# Altium schematic sheet GATE_DRIVER_BOARD.SchDoc
size A2; SheetNumber: 1; SheetTotal: 1; SPICEModelCacheUJGLTUQW: <root> / <DocumentId>UJGLTUQW</DocumentId> / <CacheFrame Number="0"> / <Model Name="7850_744775239_390u" Kind="CKT"> / <Text>******* / .subckt 7850_744775239_390u 1 2 / Rp 1 2 180000 / Cp 1 2 5p / Rs 1 N3 1.151 / L1 N3 2 390u / .ends 7850_744775239_390u</Text> / </Model> / </CacheFrame> / </root>
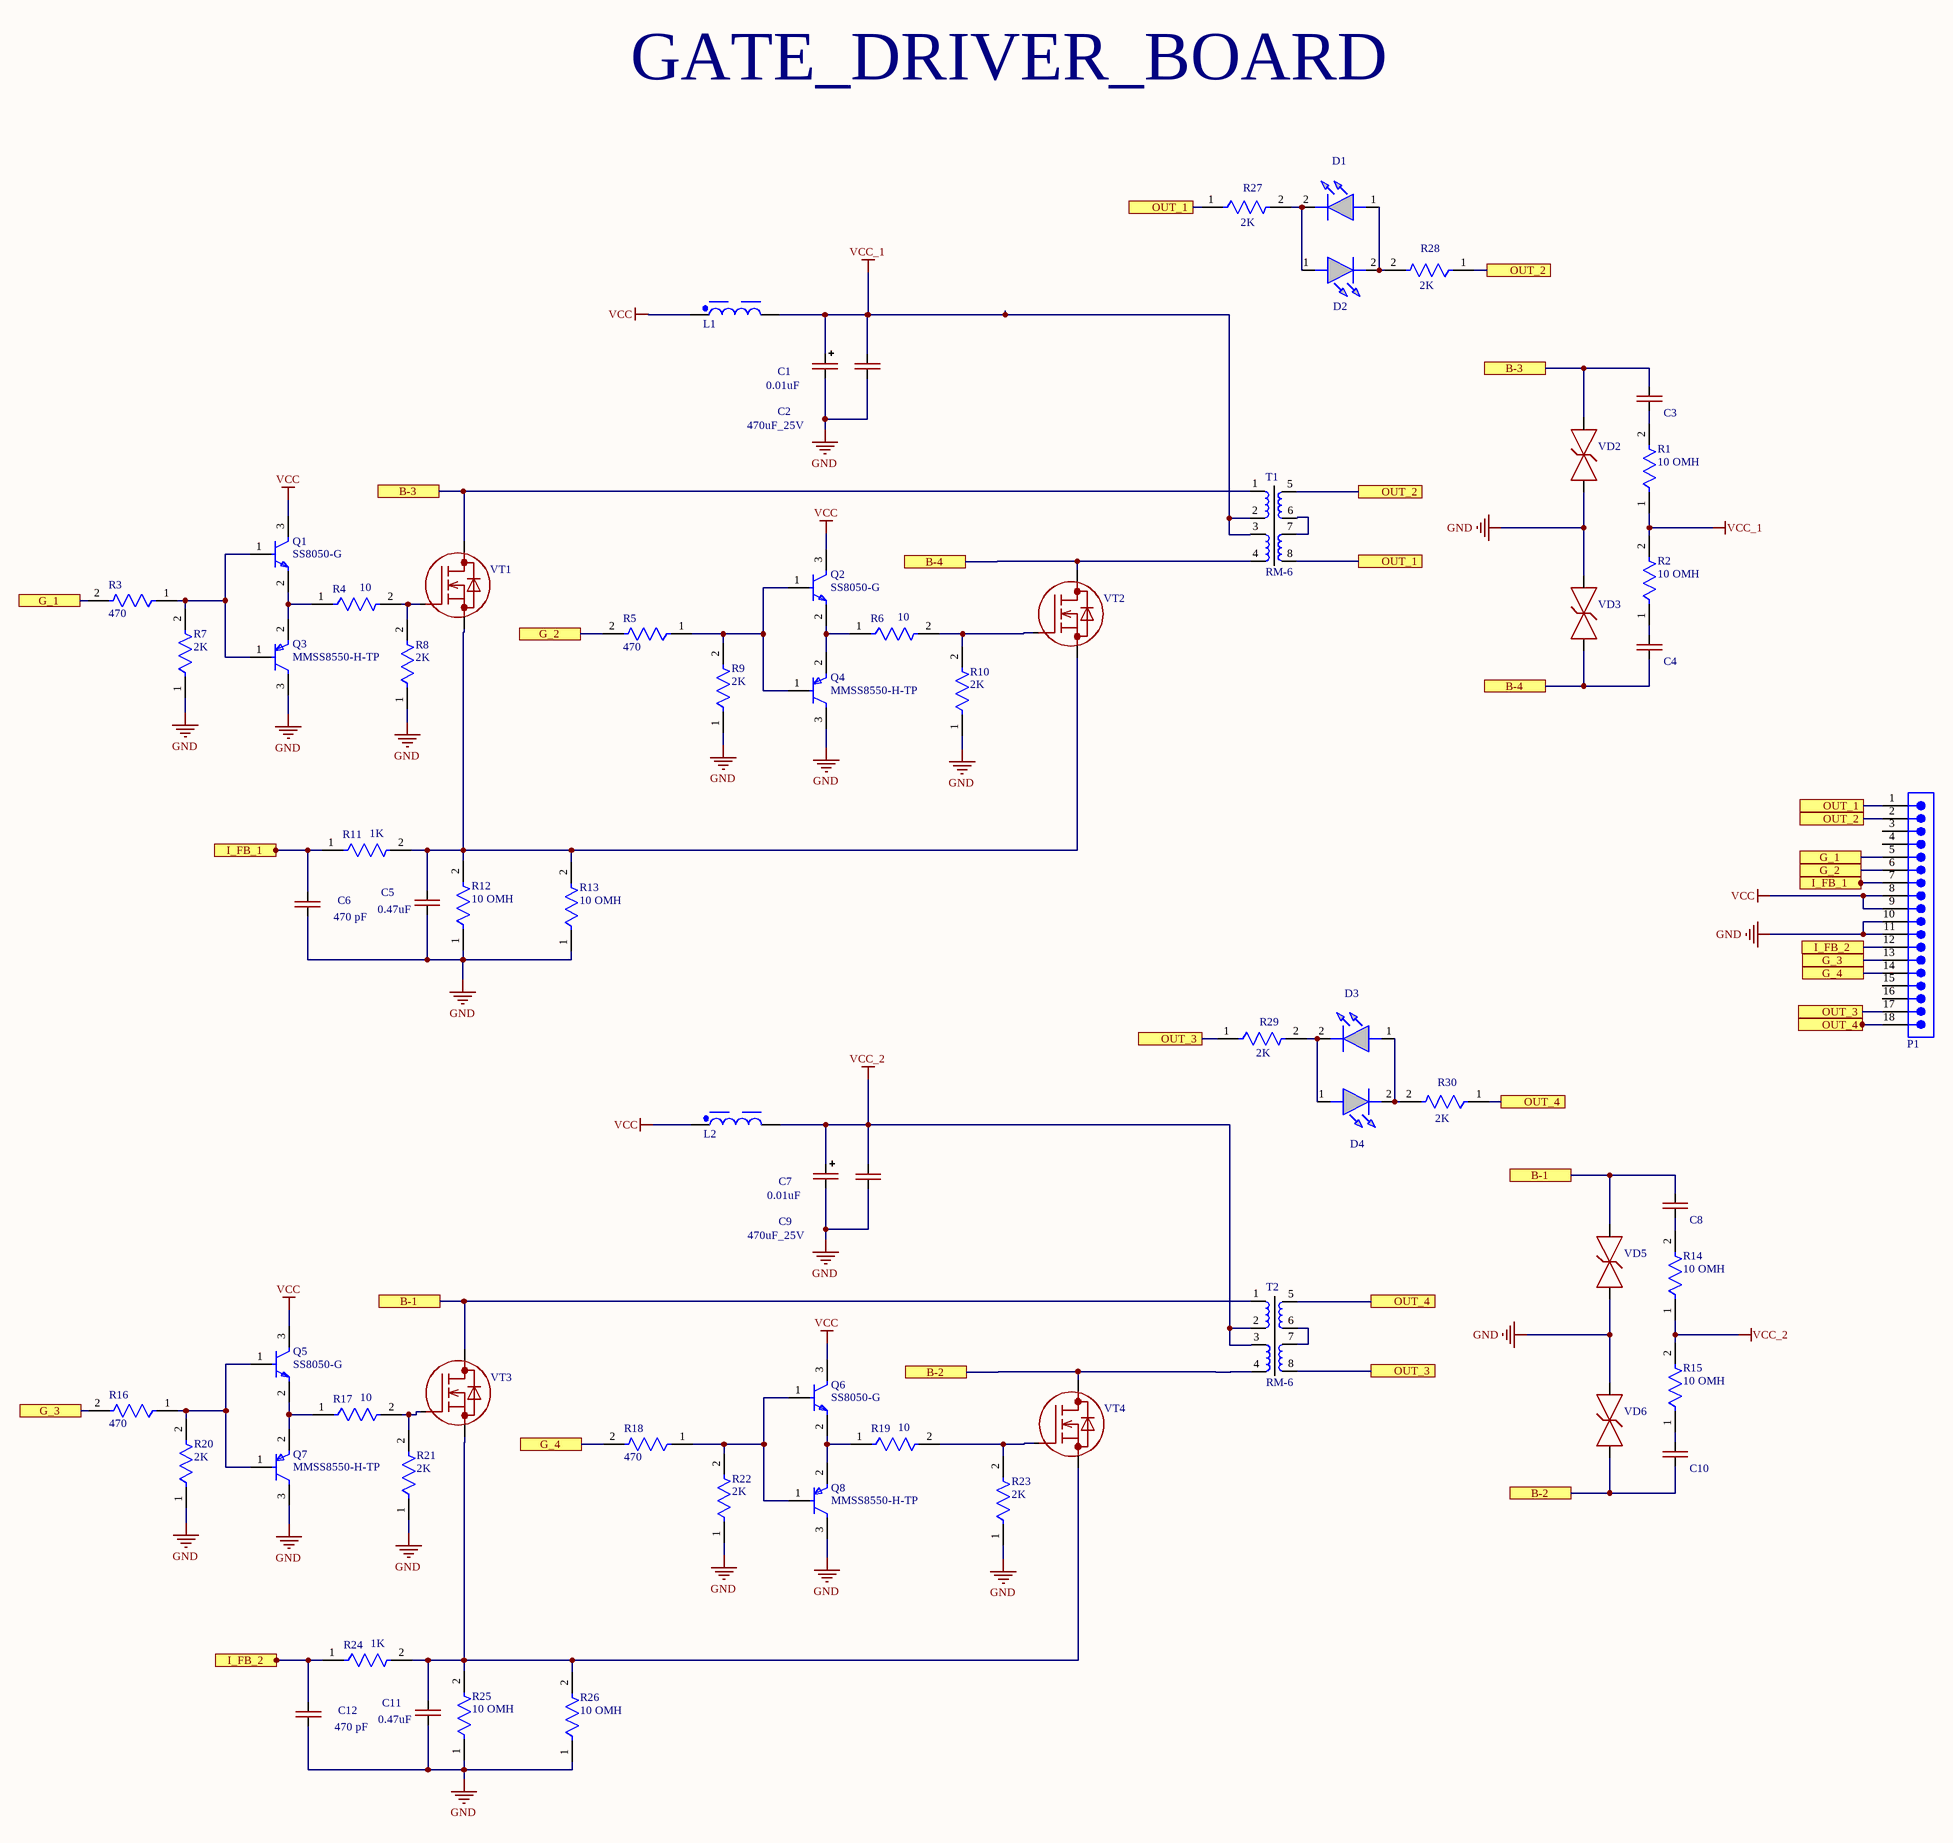
[diagram p0: GATE_DRIVER_BOARD.SchDoc]

## Parts
C1  0.01uF  [CAP-0805]
C2  470uF_25V  [CAP_SMD_Size_G]
C3  CAP-V  [CAP-V]  (value not drawn)
C4  CAP-V  [CAP-V]  (value not drawn)
C5  0.47uF  [CAP-0805]
C6  470 pF  [CAP-0805]
C7  0.01uF  [CAP-0805]
C8  CAP-V  [CAP-V]  (value not drawn)
C9  470uF_25V  [CAP_SMD_Size_G]
C10  CAP-V  [CAP-V]  (value not drawn)
C11  0.47uF  [CAP-0805]
C12  470 pF  [CAP-0805]
D1  151031YS06000  [LED_RED]  (value not drawn)
D2  151031YS06000  [LED_RED]  (value not drawn)
D3  151031YS06000  [LED_RED]  (value not drawn)
D4  151031YS06000  [LED_RED]  (value not drawn)
L1  390µH, 0.38A  [WE-PD2_7850]  (value not drawn)
L2  390µH, 0.38A  [WE-PD2_7850]  (value not drawn)
P1  61301811021  [61301811021]  (value not drawn)
Q1  SS8050-G  [FP-SS8050-G-MFG]
Q2  SS8050-G  [FP-SS8050-G-MFG]
Q3  MMSS8550-H-TP  [FP-SOT-23-IPC_B]
Q4  MMSS8550-H-TP  [FP-SOT-23-IPC_B]
Q5  SS8050-G  [FP-SS8050-G-MFG]
Q6  SS8050-G  [FP-SS8050-G-MFG]
Q7  MMSS8550-H-TP  [FP-SOT-23-IPC_B]
Q8  MMSS8550-H-TP  [FP-SOT-23-IPC_B]
R1  10 OMH  [RES-1206]
R2  10 OMH  [RES-1206]
R3  470  [RES-0805]
R4  10  [RES-0805]
R5  470  [RES-0805]
R6  10  [RES-0805]
R7  2K  [RES-0805]
R8  2K  [RES-0805]
R9  2K  [RES-0805]
R10  2K  [RES-0805]
R11  1K  [RES-0805]
R12  10 OMH  [RES-2512]
R13  10 OMH  [RES-2512]
R14  10 OMH  [RES-1206]
R15  10 OMH  [RES-1206]
R16  470  [RES-0805]
R17  10  [RES-0805]
R18  470  [RES-0805]
R19  10  [RES-0805]
R20  2K  [RES-0805]
R21  2K  [RES-0805]
R22  2K  [RES-0805]
R23  2K  [RES-0805]
R24  1K  [RES-0805]
R25  10 OMH  [RES-2512]
R26  10 OMH  [RES-2512]
R27  2K  [RES-0805]
R28  2K  [RES-0805]
R29  2K  [RES-0805]
R30  2K  [RES-0805]
T1  RM-6  [TRANS_RM6]
T2  RM-6  [TRANS_RM6]
VD2  Suppressor  [P6KE350CA]  (value not drawn)
VD3  Suppressor  [P6KE350CA]  (value not drawn)
VD5  Suppressor  [P6KE350CA]  (value not drawn)
VD6  Suppressor  [P6KE350CA]  (value not drawn)
VT1  MOSFET-N-GDS  [TO-220-5]  (value not drawn)
VT2  MOSFET-N-GDS  [TO-220-5]  (value not drawn)
VT3  MOSFET-N-GDS  [TO-220-5]  (value not drawn)
VT4  MOSFET-N-GDS  [TO-220-5]  (value not drawn)

## Ports
B-1, B-2, B-3, B-4, G_1, G_2, G_3, G_4, I_FB_1, I_FB_2, OUT_1, OUT_2, OUT_3, OUT_4

## Nets
GND: C1.1 C2.2(-) C5.1 C6.1 C7.1 C9.2(-) C11.1 C12.1 P1.10 P1.11 Q3.3(C) Q4.3(C) Q7.3(C) Q8.3(C) R7.1 R8.1 R9.1 R10.1 R12.1 R13.1 R20.1 R21.1 R22.1 R23.1 R25.1 R26.1 VD2.1(C) VD3.2(A) VD5.1(C) VD6.2(A)
VCC: L1.1 L2.1 P1.8 P1.9 Q1.3(C) Q2.3(C) Q5.3(C) Q6.3(C)
VCC_1: C1.2 C2.1(+) L1.2 R1.1 R2.2 T1.2 T1.3
VCC_2: C7.2 C9.1(+) L2.2 R14.1 R15.2 T2.2 T2.3
B-1: C8.2 T2.1 VD5.2(A) VT3.2(D) ; port B-1
B-2: C10.1 T2.4 VD6.1(C) VT4.2(D) ; port B-2
B-3: C3.2 T1.1 VD2.2(A) VT1.2(D) ; port B-3
B-4: C4.1 T1.4 VD3.1(C) VT2.2(D) ; port B-4
G_1: P1.5 R3.2 ; port G_1
G_2: P1.6 R5.2 ; port G_2
G_3: P1.13 R16.2 ; port G_3
G_4: P1.14 R18.2 ; port G_4
I_FB_1: C6.2 P1.7 R11.1 ; port I_FB_1
I_FB_2: C12.2 P1.12 R24.1 ; port I_FB_2
OUT_1: P1.1 R27.1 T1.8 ; port OUT_1
OUT_2: P1.2 R28.1 T1.5 ; port OUT_2
OUT_3: P1.17 R29.1 T2.8 ; port OUT_3
OUT_4: P1.18 R30.1 T2.5 ; port OUT_4
NetC3_1: C3.1 R1.2
NetC4_2: C4.2 R2.1
NetC5_2: C5.2 R11.2 R12.2 R13.2 VT1.3(S) VT2.3(S)
NetC8_1: C8.1 R14.2
NetC10_2: C10.2 R15.1
NetC11_2: C11.2 R24.2 R25.2 R26.2 VT3.3(S) VT4.3(S)
NetD1_1: D1.1(A) D2.2(K) R28.2
NetD1_2: D1.2(K) D2.1(A) R27.2
NetD3_1: D3.1(A) D4.2(K) R30.2
NetD3_2: D3.2(K) D4.1(A) R29.2
NetQ1_1: Q1.1(B) Q3.1(B) R3.1 R7.2
NetQ1_2: Q1.2(E) Q3.2(E) R4.1
NetQ2_1: Q2.1(B) Q4.1(B) R5.1 R9.2
NetQ2_2: Q2.2(E) Q4.2(E) R6.1
NetQ5_1: Q5.1(B) Q7.1(B) R16.1 R20.2
NetQ5_2: Q5.2(E) Q7.2(E) R17.1
NetQ6_1: Q6.1(B) Q8.1(B) R18.1 R22.2
NetQ6_2: Q6.2(E) Q8.2(E) R19.1
NetR4_2: R4.2 R8.2 VT1.1(G)
NetR6_2: R6.2 R10.2 VT2.1(G)
NetR17_2: R17.2 R21.2 VT3.1(G)
NetR19_2: R19.2 R23.2 VT4.1(G)
NetT1_6: T1.6 T1.7
NetT2_6: T2.6 T2.7

Not connected (* = marked no-connect by the designer): P1 3 4 15 16

## Notes on the sheet
- GATE_DRIVER_BOARD

## Library data of the parts
C1 C5-C7 C11 C12 = CAP-NON-POLAR
C2 C9 = CAP-POLAR
D1-D4 = LED: WURTH ELEKTRONIK - 151031YS06000 - LED, Yellow, Through Hole, T-1 (3mm), 30 mA, 2 V, 590 nm; Geometry.Height: 5.5mm; Manufacturer_Name: Wurth Elektronik; Manufacturer_Part_Number: 151031YS06000; Mouser Part Number: 710-151031YS06000; Mouser Price/Stock: https://www.mouser.co.uk/ProductDetail/Wurth-Elektronik/151031YS06000?qs=LlUlMxKIyB3xSYYW%252BcuBiQ%3D%3D; Arrow Part Number: *; Arrow Price/Stock: *; Mouser Testing Part Number: *; Mouser Testing Price/Stock: *; Datasheet Link: https://katalog.we-online.de/led/datasheet/151031YS06000.pdf
L1 L2 = 744775239: WE-PD2 SMT Power Inductor, size 7850, 390µH, 0.38A, 1.77Ω; Manufacturer: Wurth Elektronik; Case/Size Code: 7850; DC Resistance: 1.151Ω; Saturation Current: 0.43A; Self Resonant Frequency: 3.9MHz; Manufacturer Part Number: 744775239; Category: Unshielded Power Inductors; Match Code: WE-PD2; ComponentLink1Description: Website Link; ComponentLink1URL: https://www.we-online.com/redexpert/article/744775239?ad; ComponentLink2Description: Datasheet Link; ComponentLink2URL: https://www.we-online.com/redexpert/spec/744775239?ad; Mount: Surface Mount; Operating Temperature Max: 125°C; Operating Temperature Min: -40°C; Packaging: Tape and Reel; Length: 7.8mm; Width: 7mm; Height: 4.95mm; DC Resistance Max: 1.77Ω; Inductance: 390µH; Rated Current: 0.38A
P1 = 61301811021: WR-PHD Pin Header, THT, Angled, pitch 2.54mm, 1 Row, 18P; Manufacturer: Wurth Elektronik; Contact Resistance: 20mΩ; Rated Current: 3A; Working Voltage: 250V; Withstanding Voltage: 500V; ComponentLink1Description: Website Link; ComponentLink1URL: https://www.we-online.com/redexpert/article/61301811021?ad; ComponentLink2Description: Datasheet Link; ComponentLink2URL: https://www.we-online.com/redexpert/spec/61301811021?ad; Manufacturer Part Number: 61301811021; Category: Board-to-Board Connectors; Match Code: WR-PHD; Mount: Through Hole; Operating Temperature Max: 105°C; Operating Temperature Min: -40°C; Packaging: Bag; Gender: Pin Header; Number of Pins: 18; Number of Rows: 1; Orientation: Angled; Pitch: 2.54mm
Q1 Q2 Q5 Q6 = CMP-20235-000001-1: NPN TRANSISTOR 1.5A 40V SOT-23 R; Transition Frequency: 100MHz; Max Breakdown Voltage: 25V; Collector Emitter Voltage (VCEO): 400mV; Max Power Dissipation: 300mW; Max Collector Current: 1.5A; Case/Package: TO-236-3; Packaging: Tape and Reel; RoHS Compliant: Yes; Mount: Surface Mount; Collector Emitter Breakdown Voltage: 25V
Q3 Q4 Q7 Q8 = CMP-56214-000002-1: TRANS PNP 25V 1.5A SOT23; Emitter Base Voltage (VEBO): 1.6V; Collector Base Voltage (VCBO): 40V; Collector Emitter Saturation Voltage: 500mV; Max Power Dissipation: 625mW; Transition Frequency: 100MHz; Element Configuration: Single; hFE Min: 40; Polarity: PNP; Lead Free: Lead Free; Max Breakdown Voltage: 25V; Package Quantity: 1; Min Operating Temperature: -55°C; Case/Package: SOT-23; Max Collector Current: 1.5A; Mount: Surface Mount; Packaging: Tape and Reel; Collector Emitter Voltage (VCEO): 500mV; Max Operating Temperature: 150°C; Gain Bandwidth Product: 100MHz; Collector Emitter Breakdown Voltage: 25V
R1-R26 = RES-CONST
R27-R30 = RES-CONST: 10K
T1 T2 = RM_6_12-12-18-18